# EAGLE design ALU_1 (EAGLE 5.11)
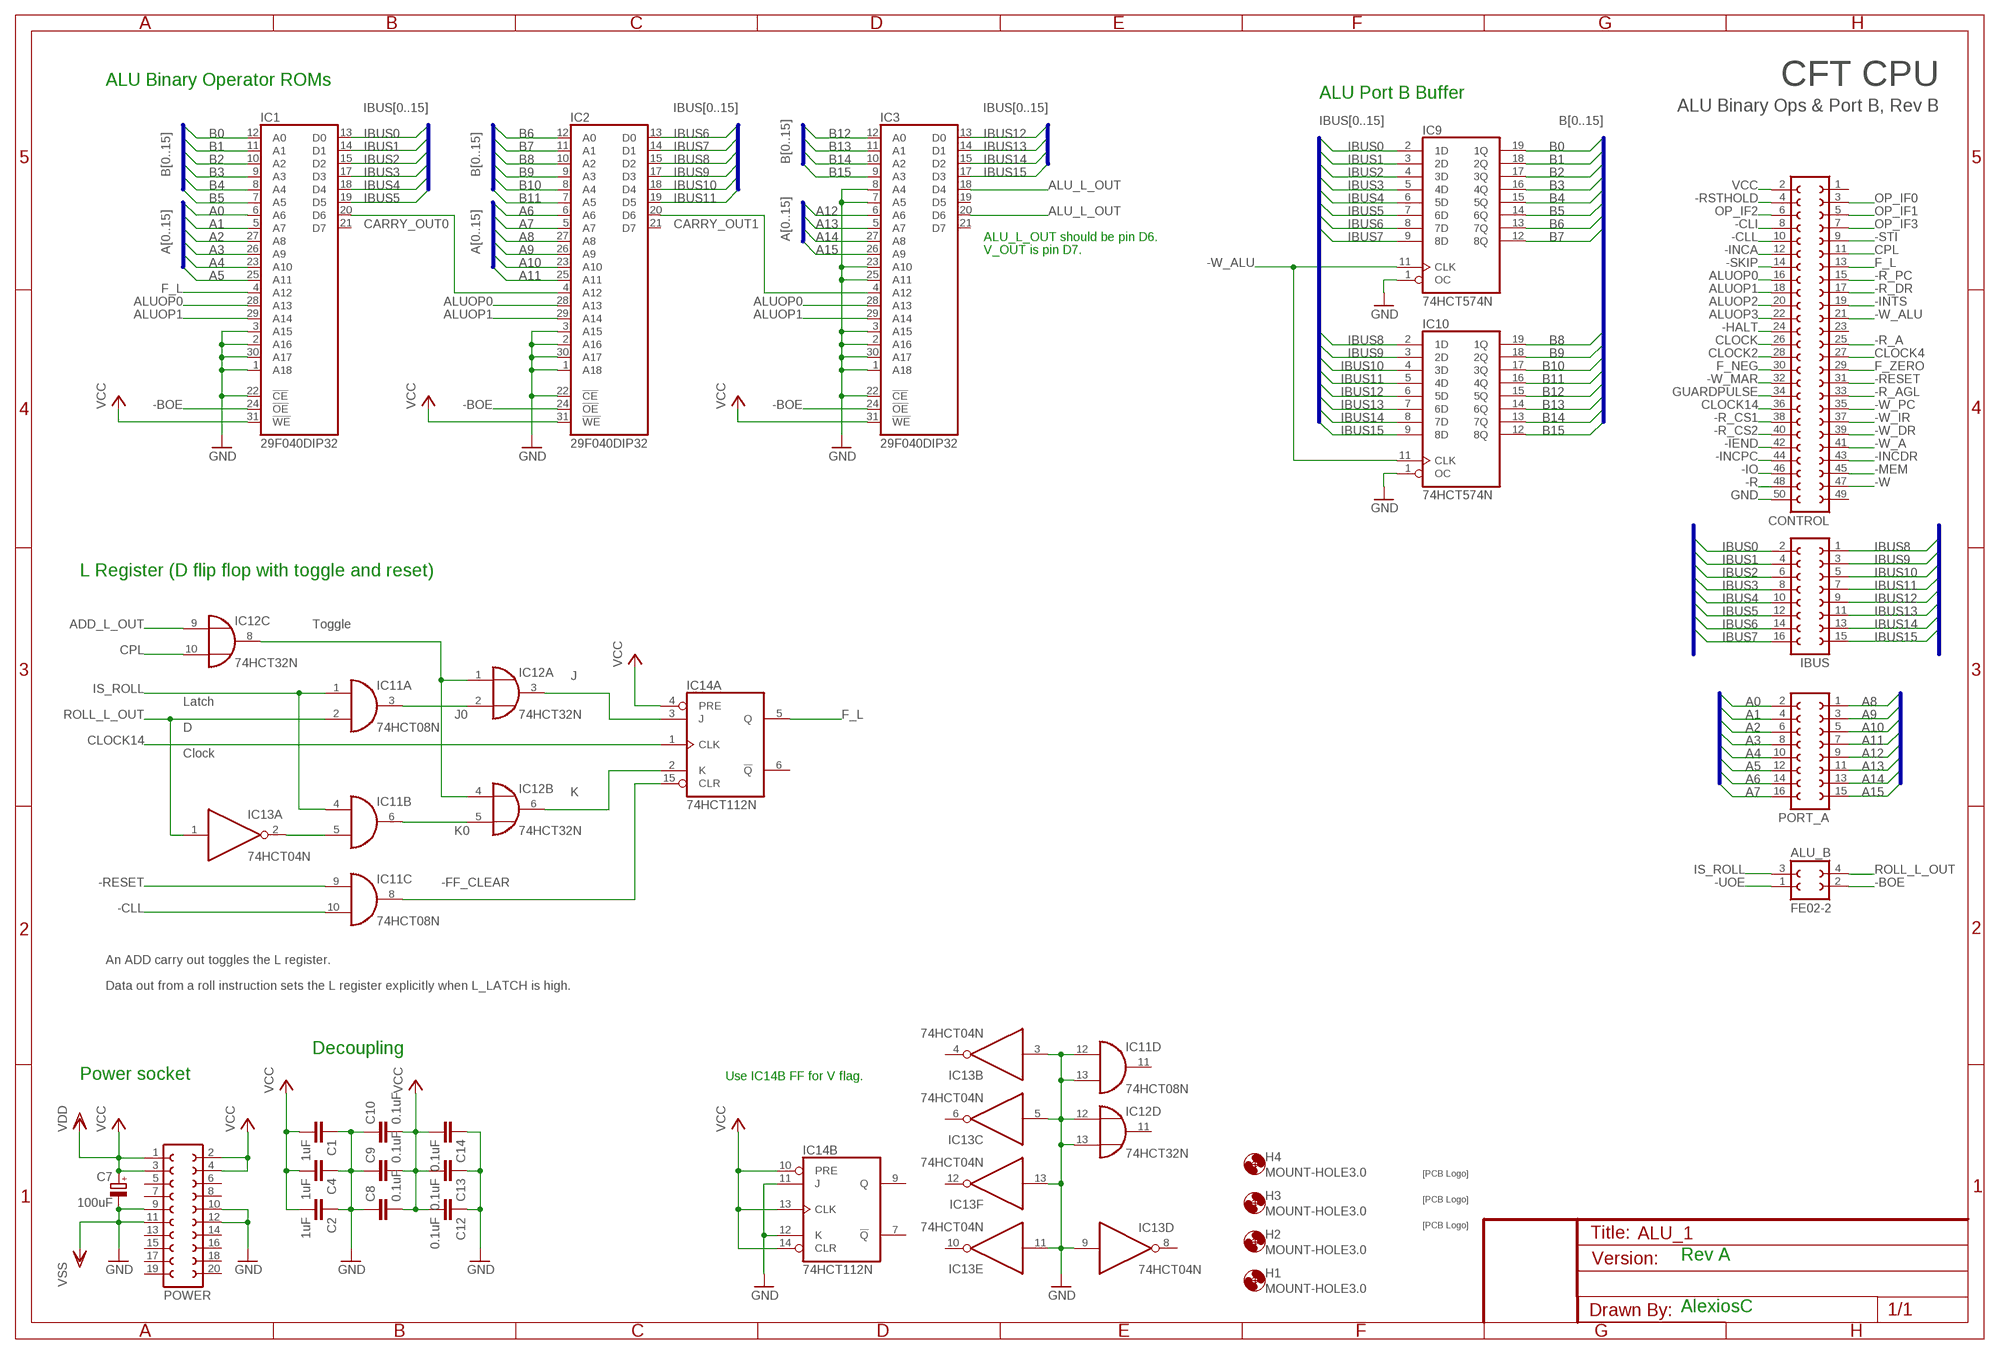
[diagram p0: schematic, sheet 1]

## Parts
ALU_B  FE02-2  [FE02-2]
C1  1uF  C-EU025-025X050  [C025-025X050]
C2  1uF  C-EU025-025X050  [C025-025X050]
C4  1uF  C-EU025-025X050  [C025-025X050]
C7  100uF  CPOL-EUE2.5-6  [E2,5-6]
C8  0.1uF  C-EU025-025X050  [C025-025X050]
C9  0.1uF  C-EU025-025X050  [C025-025X050]
C10  0.1uF  C-EU025-025X050  [C025-025X050]
C12  0.1uF  C-EU025-025X050  [C025-025X050]
C13  0.1uF  C-EU025-025X050  [C025-025X050]
C14  0.1uF  C-EU025-025X050  [C025-025X050]
CONTROL  FE25-2  [FE25-2]
H1  MOUNT-HOLE3.0  [3,0]
H2  MOUNT-HOLE3.0  [3,0]
H3  MOUNT-HOLE3.0  [3,0]
H4  MOUNT-HOLE3.0  [3,0]
IBUS  FE08-2  [FE08-2]
IC1  29F040DIP32  [DIL32]
IC2  29F040DIP32  [DIL32]
IC3  29F040DIP32  [DIL32]
IC9  74HCT574N  [DIL20]
IC10  74HCT574N  [DIL20]
IC11  74HCT08N  [DIL14]
IC12  74HCT32N  [DIL14]
IC13  74HCT04N  [DIL14]
IC14  74HCT112N  [DIL16]
PORT_A  FE08-2  [FE08-2]
POWER  FE10-2  [FE10-2]
U$1  SIGNATUREPLANE  [SIGNATURE_PLANE]
U$2  SIGNATUREPLANE  [SIGNATURE_PLANE]
U$3  SIGNATURESILK  [SIGNATURE]

## Nets
-BOE: ALU_B.2 IC1.24(!OE) IC2.24(!OE) IC3.24(!OE)
-CLI: CONTROL.8
-CLL: CONTROL.10 IC11.10(C:I1)
-FF_CLEAR: IC11.8(C:O) IC14.15(A:CLR)
-HALT: CONTROL.24
-IEND: CONTROL.42
-INCA: CONTROL.12
-INCDR: CONTROL.43
-INCPC: CONTROL.44
-INTS: CONTROL.19
-IO: CONTROL.46
-MEM: CONTROL.45
-R: CONTROL.48
-R_A: CONTROL.25
-R_AGL: CONTROL.33
-R_CS1: CONTROL.38
-R_CS2: CONTROL.40
-R_DR: CONTROL.17
-R_PC: CONTROL.15
-RESET: CONTROL.31 IC11.9(C:I0)
-RSTHOLD: CONTROL.4
-SKIP: CONTROL.14
-STI: CONTROL.9
-UOE: ALU_B.1
-W: CONTROL.47
-W_A: CONTROL.41
-W_ALU: CONTROL.21 IC9.11(CLK) IC10.11(CLK)
-W_DR: CONTROL.39
-W_IR: CONTROL.37
-W_MAR: CONTROL.32
-W_PC: CONTROL.35
A0: IC1.6(A6) PORT_A.2
A1: IC1.5(A7) PORT_A.4
A2: IC1.27(A8) PORT_A.6
A3: IC1.26(A9) PORT_A.8
A4: IC1.23(A10) PORT_A.10
A5: IC1.25(A11) PORT_A.12
A6: IC2.6(A6) PORT_A.14
A7: IC2.5(A7) PORT_A.16
A8: IC2.27(A8) PORT_A.1
A9: IC2.26(A9) PORT_A.3
A10: IC2.23(A10) PORT_A.5
A11: IC2.25(A11) PORT_A.7
A12: IC3.6(A6) PORT_A.9
A13: IC3.5(A7) PORT_A.11
A14: IC3.27(A8) PORT_A.13
A15: IC3.26(A9) PORT_A.15
ADD_L_OUT: IC12.9(C:I0)
ALU_L_OUT: IC3.18(D4)
ALUOP0: CONTROL.16 IC1.28(A13) IC2.28(A13) IC3.28(A13)
ALUOP1: CONTROL.18 IC1.29(A14) IC2.29(A14) IC3.29(A14)
ALUOP2: CONTROL.20
ALUOP3: CONTROL.22
B0: IC1.12(A0) IC9.19(1Q)
B1: IC1.11(A1) IC9.18(2Q)
B2: IC1.10(A2) IC9.17(3Q)
B3: IC1.9(A3) IC9.16(4Q)
B4: IC1.8(A4) IC9.15(5Q)
B5: IC1.7(A5) IC9.14(6Q)
B6: IC2.12(A0) IC9.13(7Q)
B7: IC2.11(A1) IC9.12(8Q)
B8: IC2.10(A2) IC10.19(1Q)
B9: IC2.9(A3) IC10.18(2Q)
B10: IC2.8(A4) IC10.17(3Q)
B11: IC2.7(A5) IC10.16(4Q)
B12: IC3.12(A0) IC10.15(5Q)
B13: IC3.11(A1) IC10.14(6Q)
B14: IC3.10(A2) IC10.13(7Q)
B15: IC3.9(A3) IC10.12(8Q)
CARRY_OUT0: IC1.20(D6) IC2.4(A12)
CARRY_OUT1: IC2.20(D6) IC3.4(A12)
CLOCK: CONTROL.26
CLOCK2: CONTROL.28
CLOCK4: CONTROL.27
CLOCK14: CONTROL.36 IC14.1(A:CLK)
CPL: CONTROL.11 IC12.10(C:I1)
F_L: CONTROL.13 IC1.4(A12) IC14.5(A:Q)
F_NEG: CONTROL.30
F_ZERO: CONTROL.29
GND: C1.1 C2.1 C4.1 C7.- C8.1 C9.1 C10.1 C12.1 C13.1 C14.1 CONTROL.50 IC1.1(A18) IC1.2(A16) IC1.3(A15) IC1.22(!CE) IC1.30(A17) IC2.1(A18) IC2.2(A16) IC2.3(A15) IC2.22(!CE) IC2.30(A17) IC3.1(A18) IC3.2(A16) IC3.3(A15) IC3.7(A5) IC3.8(A4) IC3.22(!CE) IC3.23(A10) IC3.25(A11) IC3.30(A17) IC9.1(OC) IC10.1(OC) IC11.12(D:I0) IC11.13(D:I1) IC12.12(D:I0) IC12.13(D:I1) IC13.3(B:I) IC13.5(C:I) IC13.9(D:I) IC13.11(E:I) IC13.13(F:I) IC14.11(B:J) IC14.12(B:K) POWER.9 POWER.10 POWER.11 POWER.12 ; supply symbol labelled VSS
GUARDPULSE: CONTROL.34
IBUS0: IBUS.2 IC1.13(D0) IC9.2(1D)
IBUS1: IBUS.4 IC1.14(D1) IC9.3(2D)
IBUS2: IBUS.6 IC1.15(D2) IC9.4(3D)
IBUS3: IBUS.8 IC1.17(D3) IC9.5(4D)
IBUS4: IBUS.10 IC1.18(D4) IC9.6(5D)
IBUS5: IBUS.12 IC1.19(D5) IC9.7(6D)
IBUS6: IBUS.14 IC2.13(D0) IC9.8(7D)
IBUS7: IBUS.16 IC2.14(D1) IC9.9(8D)
IBUS8: IBUS.1 IC2.15(D2) IC10.2(1D)
IBUS9: IBUS.3 IC2.17(D3) IC10.3(2D)
IBUS10: IBUS.5 IC2.18(D4) IC10.4(3D)
IBUS11: IBUS.7 IC2.19(D5) IC10.5(4D)
IBUS12: IBUS.9 IC3.13(D0) IC10.6(5D)
IBUS13: IBUS.11 IC3.14(D1) IC10.7(6D)
IBUS14: IBUS.13 IC3.15(D2) IC10.8(7D)
IBUS15: IBUS.15 IC3.17(D3) IC10.9(8D)
IS_ROLL: ALU_B.3 IC11.1(A:I0) IC11.4(B:I0)
J: IC12.3(A:O) IC14.3(A:J)
J0: IC11.3(A:O) IC12.2(A:I1)
K: IC12.6(B:O) IC14.2(A:K)
K0: IC11.6(B:O) IC12.5(B:I1)
L_TOGGLE: IC12.1(A:I0) IC12.4(B:I0) IC12.8(C:O)
N$1: IC11.5(B:I1) IC13.2(A:O)
OP_IF0: CONTROL.3
OP_IF1: CONTROL.5
OP_IF2: CONTROL.6
OP_IF3: CONTROL.7
ROLL_L_OUT: ALU_B.4 IC11.2(A:I1) IC13.1(A:I)
VCC: C1.2 C2.2 C4.2 C7.+ C8.2 C9.2 C10.2 C12.2 C13.2 C14.2 CONTROL.2 IC1.31(!WE) IC2.31(!WE) IC3.31(!WE) IC14.4(A:PRE) IC14.10(B:PRE) IC14.13(B:CLK) IC14.14(B:CLR) POWER.1 POWER.2 POWER.3 POWER.4 ; supply symbol labelled VDD
Unconnected: CONTROL.1 CONTROL.23 CONTROL.49 IC1.21(D7) IC2.21(D7) IC3.19(D5) IC3.20(D6) IC3.21(D7) IC11.11(D:O) IC12.11(D:O) IC13.4(B:O) IC13.6(C:O) IC13.8(D:O) IC13.10(E:O) IC13.12(F:O) IC14.6(A:!Q) IC14.7(B:!Q) IC14.9(B:Q) POWER.5 POWER.6 POWER.7 POWER.8 POWER.13 POWER.14 POWER.15 POWER.16 POWER.17 POWER.18 POWER.19 POWER.20

## Buses
IBUS[0..15]
A[0..15]
B[0..15]

## Notes on the sheet
- ALU Binary Operator ROMs | CFT CPU
- ALU Port B Buffer
- ALU Binary Ops & Port B, Rev B
- ALU_L_OUT should be pin D6.
- V_OUT is pin D7.
- L Register (D flip flop with toggle and reset)
- Toggle
- Latch
- D
- Clock
- An ADD carry out toggles the L register.
- Data out from a roll instruction sets the L register explicitly when L_LATCH is high.
- Decoupling
- Power socket | Use IC14B FF for V flag.
- Rev A
- AlexiosC

## Power pins joined to a net without a drawn wire
GND: IC1.16(GND) IC2.16(GND) IC3.16(GND) IC9.10(GND) IC10.10(GND) IC11.7(P:GND) IC12.7(P:GND) IC13.7(P:GND) IC14.8(P:GND)
VCC: IC1.32(VCC) IC2.32(VCC) IC3.32(VCC) IC9.20(VCC) IC10.20(VCC) IC11.14(P:VCC) IC12.14(P:VCC) IC13.14(P:VCC) IC14.16(P:VCC)

## Library data of the parts
ALU_B = alexios:FE02-2: A 2x2 pin female header.
C1 C2 C4 C8-C10 C12-C14 = rcl:C-EU: CAPACITOR, European symbol
C7 = rcl:CPOL-EU: POLARIZED CAPACITOR, European symbol
CONTROL = con-lsta:FE25-2: FEMALE HEADER
H1-H4 = holes:MOUNT-HOLE: MOUNTING HOLE with drill center marker
IBUS PORT_A = con-lsta:FE08-2: FEMALE HEADER
IC1-IC3 = alexios:29F040: 4-mbit (512x8) Flash memory in a PLCC32 package (with socket). AM29F040 is an example of this.
IC9 IC10 = 74xx-eu:74*574: 8-bit D type FLIP FLOP bus driver
IC11 = 74xx-eu:74*08: Quad 2-input AND gate
IC12 = 74xx-eu:74*32: Quad 2-input OR gate
IC13 = 74xx-eu:74*04: Hex INVERTER
IC14 = 74xx-eu:74*112: Dual J-K negative edge triggered FLIP FLOP, preset and clear
POWER = con-lsta:FE10-2: FEMALE HEADER; OC_FARNELL: unknown; OC_NEWARK: unknown
U$1-U$3 = alexios:SIGNATURE: Soup signature

## Net classes
1 Decoupling: width 1.27 mm

## Board
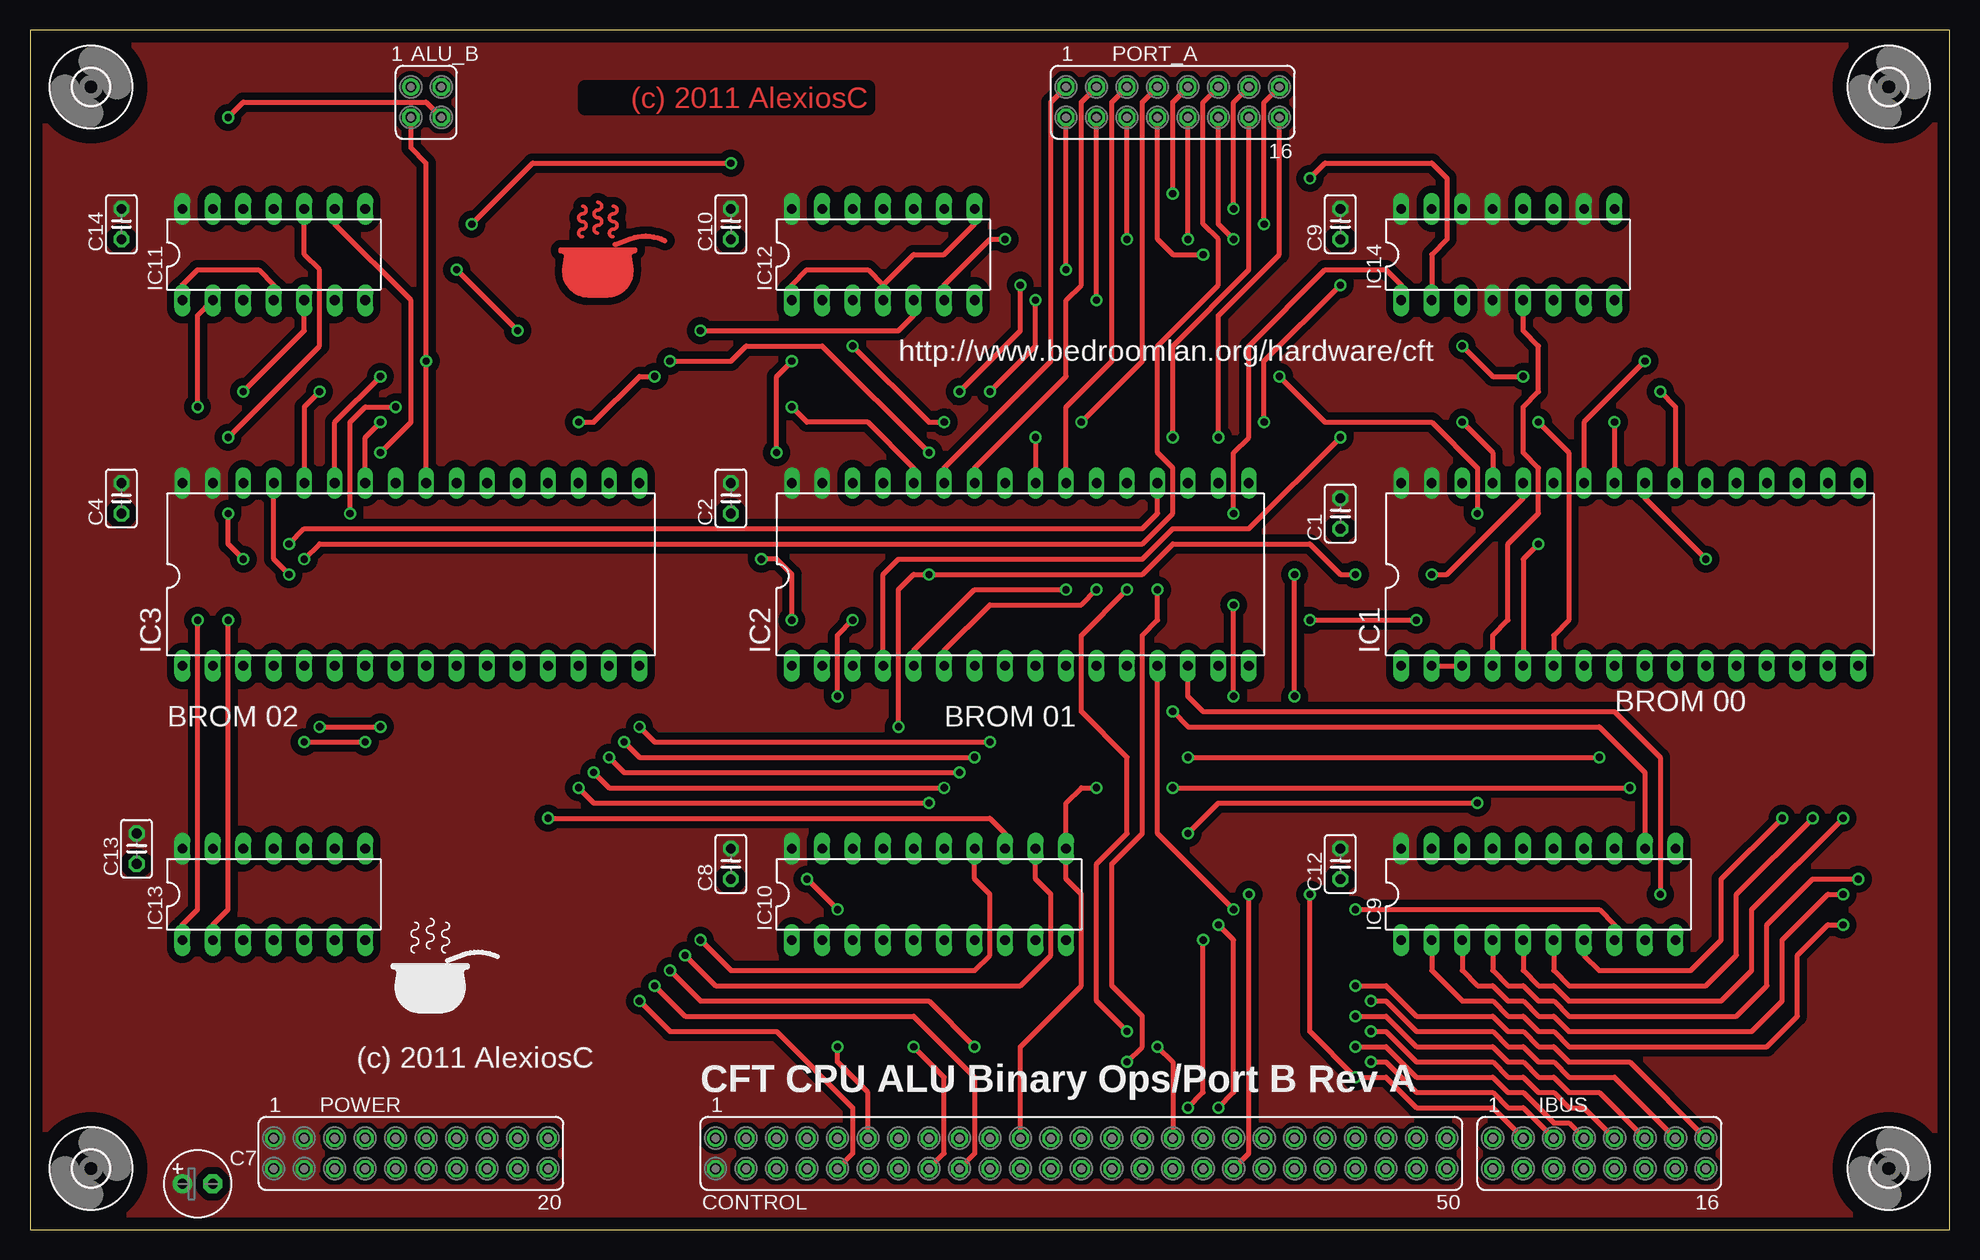
[diagram p1: board, top side]
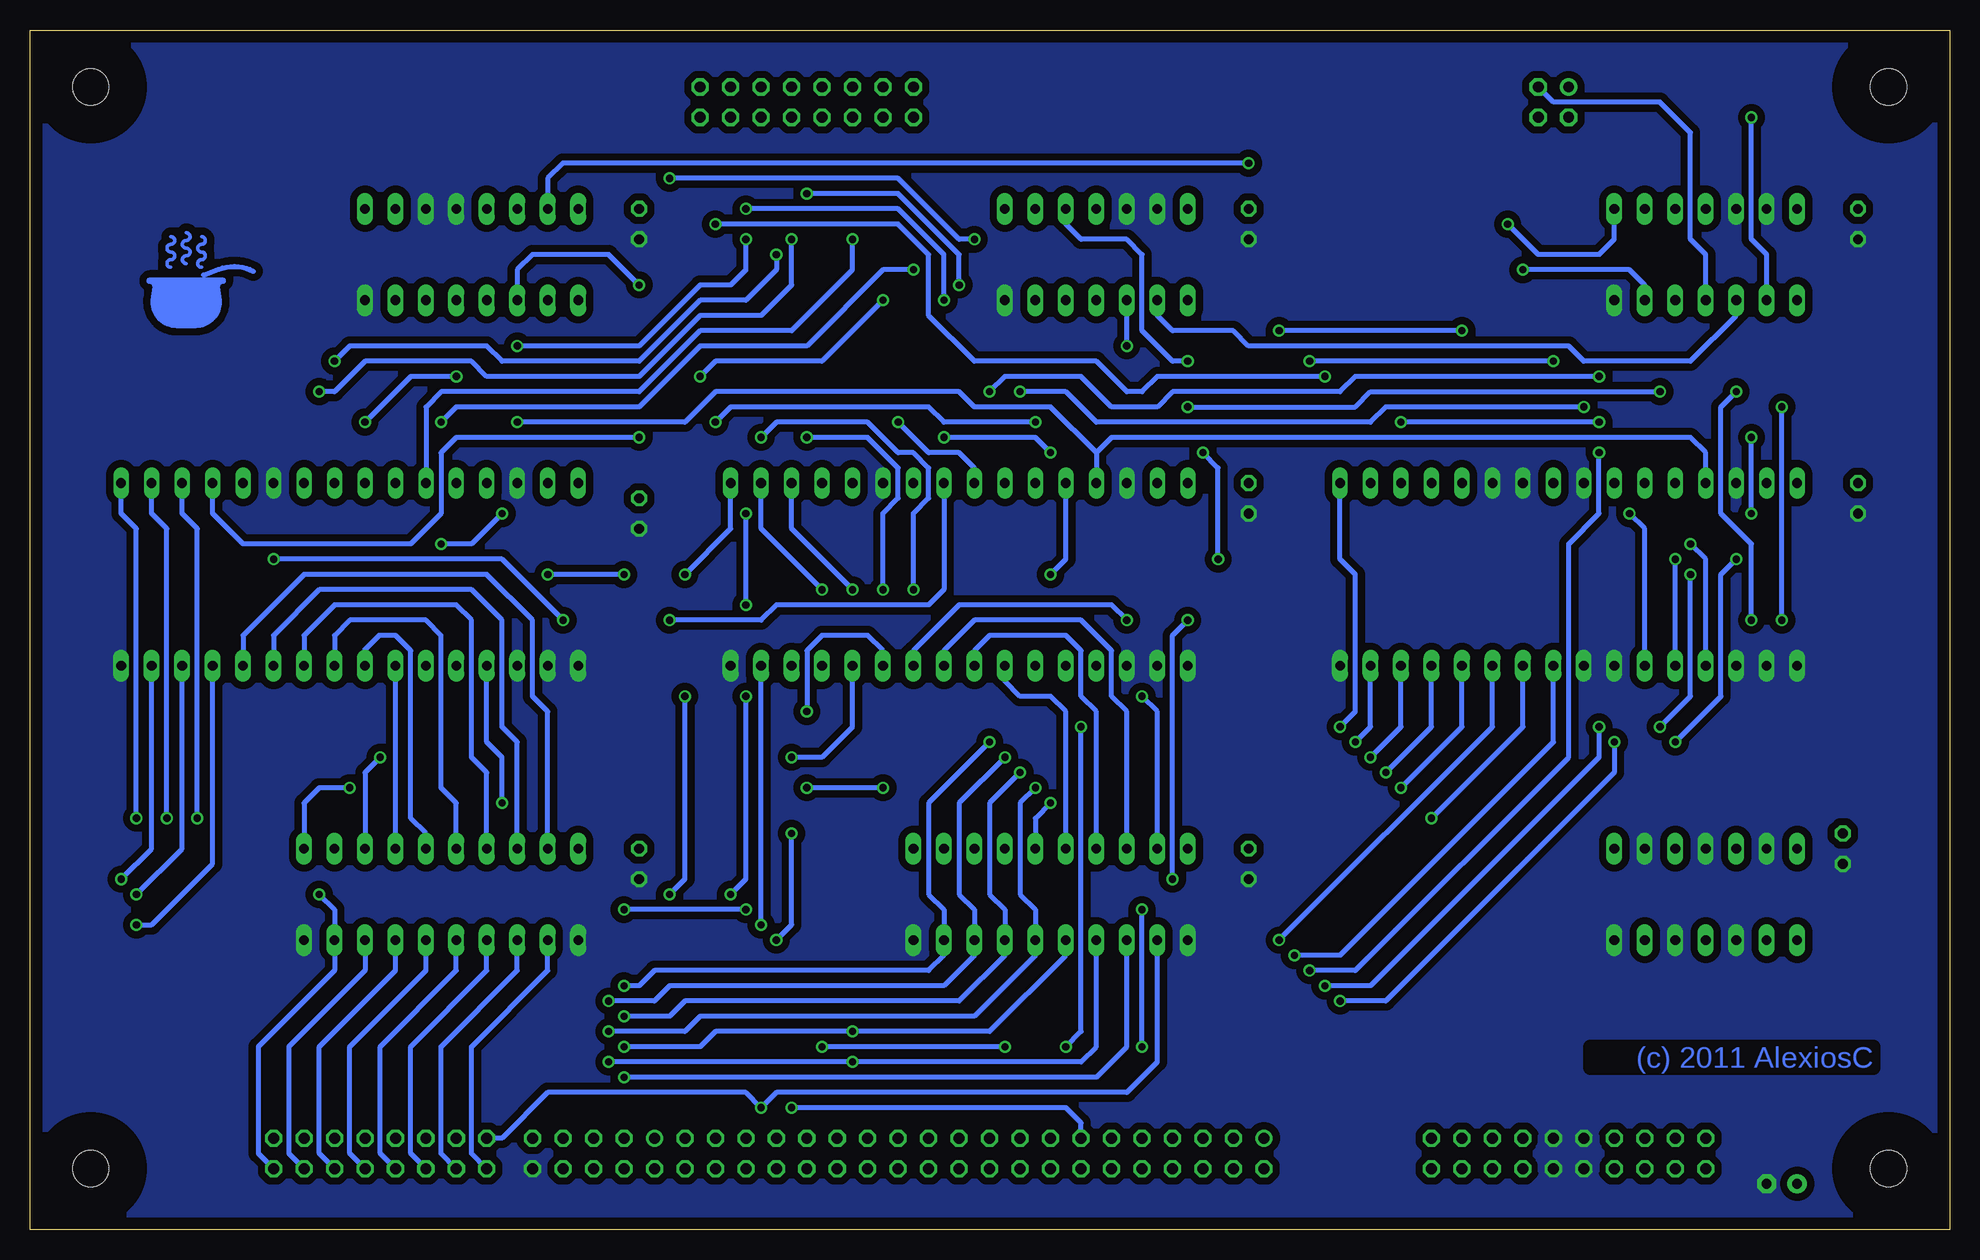
[diagram p2: board, bottom side, seen from below]

Size 160 x 100 mm. Coordinates in mm from the lower left corner, seen from the top.
Outline: 0,0 160,0 160,100 0,100 0,0
Copper layers (1*16): Top 0.035mm / dielectric 1.5mm / Bottom 0.035mm
Design rules "olimex-10mil": minimum track width 10mil, minimum drill 24mil, track to track 10mil, track to pad 10mil, pad to pad 10mil, via to via 10mil, smd to smd 10mil, copper to edge 40mil, drill to drill 10mil, minimum pad ring 10mil, minimum via ring 8mil, stop-mask expansion 0mil, vias tented up to drill 0mil, thermal gap 10mil

### Footprints (pad centres in the part's own frame; a part is rotated, then mirrored left to right if it is on the bottom)
FE02-2 = drill 0.914 round: 1 -1.27,1.27 | drill 0.914 octagon: 2 -1.27,-1.27; 3 1.27,1.27; 4 1.27,-1.27
C025-025X050 = drill 0.813 octagon: 1 -1.27,0; 2 1.27,0
E2,5-6 = drill 0.813 pad 1.6 round: + -1.27,0 | drill 0.813 pad 1.6 octagon: - 1.27,0
FE25-2 = drill 0.914 round: 1 -30.48,1.27; 41 20.32,1.27 | drill 0.914 octagon: 2 -30.48,-1.27; 3 -27.94,1.27; 4 -27.94,-1.27; 5 -25.4,1.27; 6 -25.4,-1.27; 7 -22.86,1.27; 8 -22.86,-1.27; 9 -20.32,1.27; 10 -20.32,-1.27; 11 -17.78,1.27; 12 -17.78,-1.27; 13 -15.24,1.27; 14 -15.24,-1.27; 15 -12.7,1.27; 16 -12.7,-1.27; 17 -10.16,1.27; 18 -10.16,-1.27; 19 -7.62,1.27; 20 -7.62,-1.27; 21 -5.08,1.27; 22 -5.08,-1.27; 23 -2.54,1.27; 24 -2.54,-1.27; 25 0,1.27; 26 0,-1.27; 27 2.54,1.27; 28 2.54,-1.27; 29 5.08,1.27; 30 5.08,-1.27; 31 7.62,1.27; 32 7.62,-1.27; 33 10.16,1.27; 34 10.16,-1.27; 35 12.7,1.27; 36 12.7,-1.27; 37 15.24,1.27; 38 15.24,-1.27; 39 17.78,1.27; 40 17.78,-1.27; 42 20.32,-1.27; 43 22.86,1.27; 44 22.86,-1.27; 45 25.4,1.27; 46 25.4,-1.27; 47 27.94,1.27; 48 27.94,-1.27; 49 30.48,1.27; 50 30.48,-1.27
3,0 = hole 3: 0,0
FE08-2 = drill 0.914 octagon: 1 -8.89,1.27; 2 -8.89,-1.27; 3 -6.35,1.27; 4 -6.35,-1.27; 5 -3.81,1.27; 6 -3.81,-1.27; 7 -1.27,1.27; 8 -1.27,-1.27; 9 1.27,1.27; 10 1.27,-1.27; 11 3.81,1.27; 12 3.81,-1.27; 13 6.35,1.27; 14 6.35,-1.27; 15 8.89,1.27; 16 8.89,-1.27
DIL32 = drill 0.813 long: 1 -19.05,-7.62; 2 -16.51,-7.62; 3 -13.97,-7.62; 4 -11.43,-7.62; 5 -8.89,-7.62; 6 -6.35,-7.62; 7 -3.81,-7.62; 8 -1.27,-7.62; 9 1.27,-7.62; 10 3.81,-7.62; 11 6.35,-7.62; 12 8.89,-7.62; 13 11.43,-7.62; 14 13.97,-7.62; 15 16.51,-7.62; 16 19.05,-7.62 | drill 0.8 long: 17 19.05,7.62; 18 16.51,7.62; 19 13.97,7.62; 20 11.43,7.62; 21 8.89,7.62; 22 6.35,7.62; 23 3.81,7.62; 24 1.27,7.62; 25 -1.27,7.62; 26 -3.81,7.62; 27 -6.35,7.62; 28 -8.89,7.62; 29 -11.43,7.62; 30 -13.97,7.62; 31 -16.51,7.62; 32 -19.05,7.62
DIL20 = drill 0.813 long: 1 -11.43,-3.81; 2 -8.89,-3.81; 3 -6.35,-3.81; 4 -3.81,-3.81; 5 -1.27,-3.81; 6 1.27,-3.81; 7 3.81,-3.81; 8 6.35,-3.81; 9 8.89,-3.81; 10 11.43,-3.81; 11 11.43,3.81; 12 8.89,3.81; 13 6.35,3.81; 14 3.81,3.81; 15 1.27,3.81; 16 -1.27,3.81; 17 -3.81,3.81; 18 -6.35,3.81; 19 -8.89,3.81; 20 -11.43,3.81
DIL14 = drill 0.813 long: 1 -7.62,-3.81; 2 -5.08,-3.81; 3 -2.54,-3.81; 4 0,-3.81; 5 2.54,-3.81; 6 5.08,-3.81; 7 7.62,-3.81; 8 7.62,3.81; 9 5.08,3.81; 10 2.54,3.81; 11 0,3.81; 12 -2.54,3.81; 13 -5.08,3.81; 14 -7.62,3.81
DIL16 = drill 0.813 long: 1 -8.89,-3.81; 2 -6.35,-3.81; 3 -3.81,-3.81; 4 -1.27,-3.81; 5 1.27,-3.81; 6 3.81,-3.81; 7 6.35,-3.81; 8 8.89,-3.81; 9 8.89,3.81; 10 6.35,3.81; 11 3.81,3.81; 12 1.27,3.81; 13 -1.27,3.81; 14 -3.81,3.81; 15 -6.35,3.81; 16 -8.89,3.81
FE10-2 = drill 0.914 octagon: 1 -11.43,1.27; 2 -11.43,-1.27; 3 -8.89,1.27; 4 -8.89,-1.27; 5 -6.35,1.27; 6 -6.35,-1.27; 7 -3.81,1.27; 8 -3.81,-1.27; 9 -1.27,1.27; 10 -1.27,-1.27; 11 1.27,1.27; 12 1.27,-1.27; 13 3.81,1.27; 14 3.81,-1.27; 15 6.35,1.27; 16 6.35,-1.27; 17 8.89,1.27; 18 8.89,-1.27; 19 11.43,1.27; 20 11.43,-1.27

### Placement (x,y rotation side)
ALU_B  33.02,93.98 0 top
C1  109.22,59.69 90 top
C2  58.42,60.96 90 top
C4  7.62,60.96 90 top
C7  13.97,3.81 0 top
C8  58.42,30.48 90 top
C9  109.22,83.82 90 top
C10  58.42,83.82 90 top
C12  109.22,30.48 90 top
C13  8.89,31.75 90 top
C14  7.62,83.82 90 top
CONTROL  87.63,6.35 0 top
H1  154.94,95.25 0 top
H2  154.94,5.08 0 top
H3  5.08,5.08 0 top
H4  5.08,95.25 0 top
IBUS  130.81,6.35 0 top
IC1  133.35,54.61 0 top
IC2  82.55,54.61 0 top
IC3  31.75,54.61 0 top
IC9  125.73,27.94 0 top
IC10  74.93,27.94 0 top
IC11  20.32,81.28 0 top
IC12  71.12,81.28 0 top
IC13  20.32,27.94 0 top
IC14  123.19,81.28 0 top
PORT_A  95.25,93.98 0 top
POWER  31.75,6.35 0 top
U$1  44.45,77.47 0 top
U$2  149.86,74.93 0 bottom
U$3  30.48,17.78 0 top

### Tracks (layer width: path | path; a pad name or v marks a point on that pad's centre or on a via)
-BOE  (via drill 0.6)
  Top 0.406: ALU_B.2 31.75,90.17 33.02,88.9 v33.02,72.39 IC3.24 | v83.82,66.04 IC2.24 | v53.34,72.39 58.42,72.39 59.69,73.66 66.04,73.66 v74.93,64.77 | v106.68,50.8 v115.57,50.8 | IC1.24 134.62,60.96 v139.7,55.88
  Bottom 0.406: v74.93,64.77 76.2,66.04 v83.82,66.04 | v33.02,72.39 v53.34,72.39 | IC2.24 83.82,53.34 85.09,52.07 97.79,52.07 99.06,50.8 v106.68,50.8 | v115.57,50.8 120.65,55.88 v139.7,55.88
-CLL  (via drill 0.6)
  Top 0.406: IC11.10 22.86,81.28 24.13,80.01 24.13,73.66 v16.51,66.04 | v17.78,55.88 16.51,57.15 v16.51,59.69 | v22.86,40.64 v27.94,40.64 | CONTROL.10 68.58,6.35 68.58,10.16 62.23,16.51 53.34,16.51 v50.8,19.05
  Bottom 0.406: v17.78,55.88 19.05,54.61 19.05,44.45 v22.86,40.64 | v16.51,59.69 v16.51,66.04 | v27.94,40.64 27.94,38.1 46.99,19.05 v50.8,19.05
-FF_CLEAR  (via drill 0.6)
  Top 0.406: v36.83,83.82 41.91,88.9 v58.42,88.9
  Bottom 0.406: IC14.15 116.84,87.63 115.57,88.9 v58.42,88.9 | IC11.8 27.94,82.55 29.21,81.28 34.29,81.28 v36.83,83.82
-RESET  (via drill 0.6)
  Top 0.406: v29.21,64.77 31.75,67.31 31.75,77.47 25.4,83.82 IC11.9 | CONTROL.31 95.25,13.97 v93.98,15.24 | v78.74,15.24 74.93,19.05 55.88,19.05 v53.34,21.59
  Bottom 0.406: v29.21,64.77 29.21,59.69 31.75,57.15 31.75,39.37 49.53,21.59 v53.34,21.59 | v78.74,15.24 v93.98,15.24
-W_ALU  (via drill 0.6)
  Top 0.406: CONTROL.21 82.55,15.24 87.63,20.32 87.63,27.94 86.36,29.21 IC10.11 86.36,35.56 87.63,36.83 v88.9,36.83 | v95.25,36.83 v133.35,36.83
  Bottom 0.406: IC9.11 137.16,35.56 135.89,36.83 v133.35,36.83 | v88.9,36.83 v95.25,36.83
A0  (via drill 0.6)
  Top 0.406: v86.36,80.01 PORT_A.2 | v125.73,67.31 128.27,64.77 128.27,50.8 127,49.53 IC1.6
  Bottom 0.406: v86.36,80.01 88.9,80.01 95.25,73.66 104.14,73.66 109.22,68.58 124.46,68.58 v125.73,67.31
A1  (via drill 0.6)
  Top 0.406: v120.65,59.69 120.65,63.5 116.84,67.31 107.95,67.31 v104.14,71.12 | v125.73,57.15 124.46,55.88 IC1.5 | v88.9,77.47 PORT_A.4
  Bottom 0.406: v120.65,59.69 123.19,57.15 v125.73,57.15 | v104.14,71.12 102.87,72.39 93.98,72.39 v88.9,77.47
A2  (via drill 0.6)
  Top 0.406: v91.44,82.55 PORT_A.6
  Bottom 0.406: v91.44,82.55 91.44,80.01 96.52,74.93 104.14,74.93 109.22,69.85 125.73,69.85 127,68.58 IC1.27
A3  (via drill 0.6)
  Top 0.406: v134.62,72.39 129.54,67.31 IC1.26 | v97.79,81.28 95.25,81.28 93.98,82.55 PORT_A.8
  Bottom 0.406: v97.79,81.28 97.79,80.01 100.33,77.47 104.14,77.47 109.22,72.39 120.65,72.39 121.92,73.66 133.35,73.66 v134.62,72.39
A4  (via drill 0.6)
  Top 0.406: v135.89,69.85 137.16,68.58 IC1.23 | v96.52,82.55 PORT_A.10
  Bottom 0.406: v135.89,69.85 134.62,69.85 132.08,72.39 123.19,72.39 121.92,71.12 109.22,71.12 104.14,76.2 99.06,76.2 96.52,78.74 v96.52,82.55
A5  (via drill 0.6)
  Top 0.406: v100.33,82.55 99.06,83.82 PORT_A.12 | v132.08,67.31 IC1.25 | v119.38,73.66 121.92,71.12 v124.46,71.12
  Bottom 0.406: v100.33,82.55 100.33,80.01 101.6,78.74 104.14,78.74 109.22,73.66 v119.38,73.66 | v124.46,71.12 128.27,71.12 v132.08,67.31
A6  (via drill 0.6)
  Top 0.406: PORT_A.14 101.6,80.01 95.25,73.66 v95.25,66.04 | IC2.6 76.2,48.26 80.01,52.07 87.63,52.07 v88.9,53.34
  Bottom 0.406: v95.25,66.04 90.17,66.04 87.63,63.5 87.63,60.96 88.9,59.69 v88.9,53.34
A7  (via drill 0.6)
  Top 0.406: IC2.5 73.66,48.26 78.74,53.34 v86.36,53.34 | PORT_A.16 104.14,81.28 99.06,76.2 v99.06,66.04
  Bottom 0.406: v86.36,53.34 86.36,59.69 85.09,60.96 85.09,63.5 86.36,64.77 87.63,64.77 90.17,67.31 97.79,67.31 v99.06,66.04
A8
  Top 0.406: IC2.27 76.2,63.5 85.09,72.39 85.09,93.98 PORT_A.1
A9
  Top 0.406: PORT_A.3 87.63,93.98 87.63,78.74 86.36,77.47 86.36,71.12 78.74,63.5 IC2.26
A10
  Top 0.406: PORT_A.5 90.17,93.98 90.17,72.39 86.36,68.58 IC2.23
A11  (via drill 0.6)
  Top 0.406: PORT_A.7 92.71,93.98 92.71,72.39 v87.63,67.31
  Bottom 0.406: IC2.25 81.28,63.5 82.55,64.77 85.09,64.77 v87.63,67.31
A12  (via drill 0.6)
  Top 0.406: PORT_A.9 95.25,93.98 v95.25,86.36 | v30.48,68.58 27.94,68.58 26.67,67.31 v26.67,59.69 | v82.55,78.74 82.55,74.93 v77.47,69.85
  Bottom 0.406: v95.25,86.36 87.63,86.36 82.55,81.28 v82.55,78.74 | v77.47,69.85 73.66,69.85 71.12,67.31 48.26,67.31 46.99,68.58 v30.48,68.58 | IC3.6 25.4,58.42 v26.67,59.69
A13  (via drill 0.6)
  Top 0.406: PORT_A.11 97.79,93.98 97.79,83.82 99.06,82.55 99.06,78.74 93.98,73.66 93.98,64.77 95.25,63.5 95.25,59.69 92.71,57.15 24.13,57.15 v22.86,55.88
  Bottom 0.406: IC3.5 v22.86,55.88
A14  (via drill 0.6)
  Top 0.406: PORT_A.13 100.33,93.98 v100.33,85.09 | IC3.27 25.4,67.31 v29.21,71.12 | v80.01,69.85 83.82,73.66 v83.82,77.47
  Bottom 0.406: v100.33,85.09 87.63,85.09 83.82,81.28 v83.82,77.47 | v80.01,69.85 78.74,71.12 72.39,71.12 69.85,68.58 66.04,68.58 64.77,69.85 50.8,69.85 49.53,71.12 v29.21,71.12
A15  (via drill 0.6)
  Top 0.406: PORT_A.15 102.87,93.98 v102.87,83.82 | IC3.26 27.94,66.04 v29.21,67.31 | v45.72,67.31 46.99,67.31 50.8,71.12 v52.07,71.12
  Bottom 0.406: v29.21,67.31 v45.72,67.31 | v52.07,71.12 66.04,71.12 67.31,69.85 68.58,69.85 71.12,72.39 81.28,72.39 85.09,76.2 85.09,81.28 87.63,83.82 v102.87,83.82
ALUOP0  (via drill 0.6)
  Top 0.406: CONTROL.16 76.2,6.35 76.2,12.7 v73.66,15.24 | v72.39,41.91 72.39,53.34 73.66,54.61 v74.93,54.61 92.71,54.61 95.25,57.15 106.68,57.15 109.22,54.61 v110.49,54.61 | IC3.28 22.86,68.58 v24.13,69.85 | v63.5,68.58 64.77,67.31 69.85,67.31 73.66,63.5 IC2.28 | v116.84,54.61 118.11,54.61 124.46,60.96 IC1.28
  Bottom 0.406: v73.66,15.24 72.39,16.51 v72.39,41.91 | v74.93,54.61 73.66,55.88 IC2.28 | v63.5,68.58 49.53,68.58 48.26,69.85 v24.13,69.85 | v110.49,54.61 v116.84,54.61
ALUOP1  (via drill 0.6)
  Top 0.406: CONTROL.18 78.74,6.35 78.74,12.7 73.66,17.78 54.61,17.78 v52.07,20.32 | v21.59,54.61 20.32,55.88 IC3.29 | v119.38,67.31 121.92,64.77 IC1.29 | v24.13,41.91 v29.21,41.91
  Bottom 0.406: IC3.29 20.32,64.77 21.59,66.04 69.85,66.04 71.12,64.77 | 71.12,64.77 IC2.29 | v119.38,67.31 105.41,67.31 102.87,69.85 82.55,69.85 81.28,68.58 74.93,68.58 71.12,64.77 | v21.59,54.61 21.59,44.45 v24.13,41.91 | v52.07,20.32 48.26,20.32 29.21,39.37 v29.21,41.91
B0
  Bottom 0.406: IC9.19 116.84,43.18 118.11,44.45 118.11,50.8 121.92,54.61 137.16,54.61 142.24,49.53 IC1.12
B1
  Bottom 0.406: IC9.18 119.38,40.64 120.65,41.91 120.65,50.8 123.19,53.34 135.89,53.34 139.7,49.53 IC1.11
B2
  Bottom 0.406: IC9.17 121.92,38.1 123.19,39.37 123.19,50.8 124.46,52.07 134.62,52.07 137.16,49.53 IC1.10
B3
  Bottom 0.406: IC1.9 134.62,49.53 133.35,50.8 127,50.8 125.73,49.53 125.73,36.83 124.46,35.56 IC9.16
B4
  Bottom 0.406: IC9.15 127,33.02 128.27,34.29 128.27,48.26 129.54,49.53 130.91,49.53 132.08,48.36 IC1.8
B5
  Bottom 0.406: IC9.14 IC1.7
B6  (via drill 0.6)
  Top 0.406: v96.52,39.37 v130.81,39.37
  Bottom 0.406: IC9.13 132.08,38.1 v130.81,39.37 | v96.52,39.37 93.98,39.37 91.44,41.91 IC2.12
B7  (via drill 0.6)
  Top 0.406: IC9.12 134.62,38.1 130.81,41.91 96.52,41.91 v95.25,43.18
  Bottom 0.406: v95.25,43.18 95.25,48.26 93.98,49.53 90.17,49.53 88.9,48.26 IC2.11
B8  (via drill 0.6)
  Top 0.406: v67.31,44.45 67.31,49.53 v68.58,50.8
  Bottom 0.406: IC10.19 66.04,43.18 v67.31,44.45 | v68.58,50.8 69.85,52.07 82.55,52.07 86.36,48.26 IC2.10
B9
  Bottom 0.406: IC10.18 68.58,43.18 69.85,44.45 69.85,48.26 72.39,50.8 81.28,50.8 83.82,48.26 IC2.9
B10
  Bottom 0.406: IC10.17 71.12,43.18 72.39,44.45 72.39,48.26 73.66,49.53 80.01,49.53 81.28,48.26 IC2.8
B11
  Bottom 0.406: IC10.16 73.66,43.18 74.93,44.45 77.47,44.45 78.74,45.72 IC2.7
B12  (via drill 0.6)
  Top 0.406: v74.93,35.56 46.99,35.56 v45.72,36.83
  Bottom 0.406: v74.93,35.56 76.2,34.29 IC10.15 | IC3.12 40.64,41.91 v45.72,36.83
B13  (via drill 0.6)
  Top 0.406: v55.88,24.13 58.42,21.59 78.74,21.59 80.01,22.86 80.01,27.94 78.74,29.21 IC10.14
  Bottom 0.406: IC3.11 38.1,41.91 v55.88,24.13
B14  (via drill 0.6)
  Top 0.406: v43.18,34.29 80.01,34.29 81.28,33.02 IC10.13
  Bottom 0.406: IC3.10 35.56,41.91 v43.18,34.29
B15  (via drill 0.6)
  Top 0.406: IC10.12 83.82,29.21 85.09,27.94 85.09,22.86 82.55,20.32 57.15,20.32 v54.61,22.86
  Bottom 0.406: IC3.9 33.02,40.64 50.8,22.86 v54.61,22.86
CARRY_OUT0  (via drill 0.6)
  Top 0.406: IC2.4 71.12,54.61 72.39,55.88 92.71,55.88 95.25,58.42 101.6,58.42 v109.22,66.04
  Bottom 0.406: v109.22,66.04 124.46,66.04 125.73,64.77 125.73,59.69 128.27,57.15 142.24,57.15 144.78,59.69 IC1.20
CARRY_OUT1  (via drill 0.6)
  Top 0.406: v21.59,57.15 22.86,58.42 92.71,58.42 93.98,59.69 IC2.20
  Bottom 0.406: IC3.4 20.32,55.88 v21.59,57.15
CLOCK14  (via drill 0.6)
  Top 0.406: CONTROL.36 101.6,6.35 v101.6,27.94 | v100.33,59.69 100.33,64.77 101.6,66.04 101.6,73.66 107.95,80.01 113.03,80.01 114.3,78.74 IC14.1 | v100.33,44.45 v100.33,52.07
  Bottom 0.406: v101.6,27.94 100.33,29.21 v100.33,44.45 | v100.33,52.07 v100.33,59.69
CPL  (via drill 0.6)
  Top 0.406: v67.31,26.67 v64.77,29.21 | v67.31,15.24 67.31,13.97 69.85,11.43 CONTROL.11 | v62.23,64.77 62.23,71.12 v63.5,72.39 | v63.5,50.8 63.5,54.61 62.23,55.88 v60.96,55.88
  Bottom 0.406: v60.96,55.88 60.96,63.5 v62.23,64.77 | v64.77,29.21 64.77,49.53 v63.5,50.8 | v67.31,15.24 v67.31,26.67 | v63.5,72.39 64.77,72.39 67.31,74.93 67.31,81.28 68.58,82.55 72.39,82.55 73.66,83.82 IC12.10
F_L  (via drill 0.6)
  Top 0.406: IC14.5 124.46,74.93 125.73,73.66 125.73,69.85 124.46,68.58 124.46,64.77 125.73,63.5 125.73,59.69 123.19,57.15 123.19,50.8 121.92,49.53 IC1.4 | v96.52,33.02 99.06,35.56 v120.65,35.56 | v96.52,10.16 97.79,11.43 v97.79,24.13
  Bottom 0.406: IC1.4 121.92,40.64 120.65,39.37 v120.65,35.56 | v97.79,24.13 96.52,25.4 v96.52,33.02 | v96.52,10.16 73.66,10.16 72.39,8.89 CONTROL.13
GND
  Top 0.406: IC1.2 IC1.3
  pour Bottom (isolate 0.508, no thermals): 30.48,8.89 29.21,7.62 29.21,5.08 30.48,3.81 33.02,3.81 34.29,5.08 34.29,7.62 33.02,8.89
  pour Bottom (isolate 0.61, no thermals): 0,100.33 0,0 160.02,0 160.02,100.33
IBUS0  (via drill 0.6)
  Top 0.406: IC9.2 116.84,21.59 119.38,19.05 121.92,19.05 123.19,17.78 124.46,17.78 125.73,16.51 127,16.51 128.27,15.24 144.78,15.24 147.32,17.78 147.32,22.86 149.86,25.4 v151.13,25.4
  Bottom 0.406: IBUS.2 123.19,6.35 123.19,15.24 116.84,21.59 IC9.2 | v151.13,25.4 149.86,25.4 144.78,30.48 IC1.13
IBUS1  (via drill 0.6)
  Top 0.406: IC9.3 119.38,21.59 120.65,20.32 121.92,20.32 123.19,19.05 124.46,19.05 125.73,17.78 127,17.78 128.27,16.51 143.51,16.51 146.05,19.05 146.05,24.13 149.86,27.94 v151.13,27.94
  Bottom 0.406: IBUS.4 125.73,6.35 125.73,15.24 119.38,21.59 IC9.3 | v151.13,27.94 147.32,31.75 IC1.14
IBUS2  (via drill 0.6)
  Top 0.406: IC9.4 121.92,21.59 123.19,20.32 124.46,20.32 125.73,19.05 127,19.05 128.27,17.78 142.24,17.78 144.78,20.32 144.78,25.4 148.59,29.21 v152.4,29.21
  Bottom 0.406: IBUS.6 128.27,6.35 128.27,15.24 121.92,21.59 IC9.4 | v152.4,29.21 149.86,31.75 IC1.15
IBUS3  (via drill 0.6)
  Top 0.406: IC9.5 124.46,21.59 125.73,20.32 127,20.32 128.27,19.05 140.97,19.05 143.51,21.59 143.51,26.67 v151.13,34.29
  Bottom 0.406: IBUS.8 130.81,6.35 130.81,15.24 124.46,21.59 IC9.5 | v151.13,34.29 151.13,58.42 152.4,59.69 IC1.17
IBUS4  (via drill 0.6)
  Top 0.406: IC9.6 127,21.59 128.27,20.32 139.7,20.32 142.24,22.86 142.24,27.94 v148.59,34.29
  Bottom 0.406: IBUS.10 133.35,6.35 133.35,15.24 127,21.59 IC9.6 | v148.59,34.29 148.59,58.42 149.86,59.69 IC1.18
IBUS5  (via drill 0.6)
  Top 0.406: IC9.7 129.54,22.86 130.81,21.59 138.43,21.59 140.97,24.13 140.97,29.21 v146.05,34.29
  Bottom 0.406: IBUS.12 135.89,6.35 135.89,15.24 129.54,21.59 IC9.7 | v146.05,34.29 146.05,58.42 147.32,59.69 IC1.19
IBUS6  (via drill 0.6)
  Top 0.406: IC9.8 132.08,25.4 130.81,26.67 v110.49,26.67 | IC2.13 93.98,33.02 v100.33,26.67
  Bottom 0.406: IBUS.14 138.43,6.35 138.43,15.24 132.08,21.59 IC9.8 | v100.33,26.67 v110.49,26.67
IBUS7  (via drill 0.6)
  Top 0.406: IC2.14 96.52,44.45 97.79,43.18 132.08,43.18 135.89,39.37 v135.89,27.94
  Bottom 0.406: IBUS.16 140.97,6.35 140.97,15.24 134.62,21.59 IC9.9 134.62,26.67 v135.89,27.94
IBUS8  (via drill 0.6)
  Top 0.406: v99.06,10.16 100.33,11.43 100.33,24.13 v99.06,25.4
  Bottom 0.406: IC10.2 66.04,13.97 68.58,11.43 97.79,11.43 v99.06,10.16 100.33,11.43 116.84,11.43 120.65,7.62 IBUS.1 | v99.06,25.4 IC2.15
IBUS9  (via drill 0.6)
  Top 0.406: IBUS.3 121.92,10.16 115.57,10.16 113.03,12.7 v110.49,12.7 106.68,16.51 v106.68,27.94 | v105.41,44.45 v105.41,54.61
  Bottom 0.406: IC10.3 68.58,15.24 71.12,12.7 v110.49,12.7 | IC2.17 101.6,58.42 v105.41,54.61 | v106.68,27.94 105.41,29.21 v105.41,44.45
IBUS10  (via drill 0.6)
  Top 0.406: v111.76,13.97 113.03,13.97 115.57,11.43 121.92,11.43 123.19,10.16 124.46,10.16 IBUS.5 | v93.98,53.34 93.98,50.8 92.71,49.53 92.71,33.02 90.17,30.48 90.17,20.32 92.71,17.78 92.71,15.24 v91.44,13.97
  Bottom 0.406: IC10.4 71.12,15.24 72.39,13.97 v91.44,13.97 v111.76,13.97 | IC2.18 99.06,58.42 v93.98,53.34
IBUS11  (via drill 0.6)
  Top 0.406: IBUS.7 128.27,8.89 127,8.89 124.46,11.43 123.19,11.43 121.92,12.7 115.57,12.7 113.03,15.24 v110.49,15.24 | v91.44,53.34 87.63,49.53 87.63,43.18 91.44,39.37 91.44,33.02 88.9,30.48 88.9,19.05 v91.44,16.51
  Bottom 0.406: v110.49,15.24 104.14,15.24 102.87,16.51 v91.44,16.51 80.01,16.51 73.66,22.86 IC10.5 | IC2.19 96.52,58.42 v91.44,53.34
IBUS12  (via drill 0.6)
  Top 0.406: v111.76,16.51 113.03,16.51 115.57,13.97 121.92,13.97 123.19,12.7 124.46,12.7 125.73,11.43 127,11.43 128.27,10.16 129.54,10.16 IBUS.9 | v46.99,38.1 48.26,36.83 v76.2,36.83
  Bottom 0.406: v111.76,16.51 105.41,16.51 104.14,17.78 81.28,17.78 76.2,22.86 IC10.6 76.2,26.67 77.47,27.94 77.47,35.56 v76.2,36.83 | IC3.13 43.18,41.91 v46.99,38.1
IBUS13  (via drill 0.6)
  Top 0.406: IBUS.11 130.81,11.43 128.27,11.43 127,12.7 125.73,12.7 124.46,13.97 123.19,13.97 121.92,15.24 115.57,15.24 113.03,17.78 v110.49,17.78 | v48.26,39.37 49.53,38.1 v77.47,38.1
  Bottom 0.406: v110.49,17.78 106.68,17.78 105.41,19.05 82.55,19.05 78.74,22.86 IC10.7 78.74,26.67 80.01,27.94 80.01,35.56 v77.47,38.1 | IC3.14 45.72,41.91 v48.26,39.37
IBUS14  (via drill 0.6)
  Top 0.406: IBUS.13 132.08,12.7 128.27,12.7 127,13.97 125.73,13.97 124.46,15.24 123.19,15.24 121.92,16.51 115.57,16.51 113.03,19.05 v111.76,19.05 | v49.53,40.64 50.8,39.37 v78.74,39.37
  Bottom 0.406: v111.76,19.05 107.95,19.05 106.68,20.32 83.82,20.32 81.28,22.86 IC10.8 81.28,26.67 82.55,27.94 82.55,35.56 v78.74,39.37 | IC3.15 48.26,41.91 v49.53,40.64
IBUS15  (via drill 0.6)
  Top 0.406: IBUS.15 133.35,13.97 128.27,13.97 127,15.24 125.73,15.24 124.46,16.51 123.19,16.51 121.92,17.78 115.57,17.78 113.03,20.32 v110.49,20.32 | v80.01,40.64 52.07,40.64 v50.8,41.91
  Bottom 0.406: v110.49,20.32 109.22,20.32 107.95,21.59 85.09,21.59 83.82,22.86 IC10.9 83.82,26.67 85.09,27.94 85.09,35.56 v80.01,40.64 | v50.8,41.91 49.53,43.18 49.53,54.61 50.8,55.88 IC3.17
IS_ROLL
  Top 0.406: IC11.1 12.7,78.74 13.97,80.01 19.05,80.01 20.32,78.74 IC11.4
  Bottom 0.406: ALU_B.3 33.02,93.98 24.13,93.98 21.59,91.44 21.59,82.55 20.32,81.28 IC11.4
J  (via drill 0.6)
  Top 0.406: v109.22,78.74 102.87,72.39 v102.87,67.31 | v68.58,73.66 74.93,67.31 v76.2,67.31
  Bottom 0.406: v102.87,67.31 101.6,68.58 85.09,68.58 83.82,67.31 v76.2,67.31 | v68.58,73.66 IC12.3 | v109.22,78.74 111.76,81.28 118.11,81.28 119.38,80.01 IC14.3
J0
  Bottom 0.406: IC11.3 17.78,76.2 21.59,72.39 30.48,72.39 31.75,73.66 58.42,73.66 59.69,74.93 64.77,74.93 66.04,76.2 IC12.2
K  (via drill 0.6)
  Top 0.406: IC12.6 76.2,78.74 80.01,82.55 v81.28,82.55 | v106.68,87.63 107.95,88.9 116.84,88.9 118.11,87.63 118.11,82.55 116.84,81.28 IC14.2
  Bottom 0.406: v81.28,82.55 82.55,82.55 87.63,87.63 v106.68,87.63
K0  (via drill 0.6)
  Top 0.406: v35.56,80.01 v40.64,74.93 | IC12.5 73.66,76.2 72.39,74.93 v55.88,74.93
  Bottom 0.406: v40.64,74.93 v55.88,74.93 | IC11.6 25.4,78.74 26.67,80.01 v35.56,80.01
L_TOGGLE
  Top 0.406: IC12.8 78.74,83.82 76.2,81.28 73.66,81.28 71.12,78.74 | 71.12,78.74 IC12.4 | IC12.1 63.5,78.74 64.77,80.01 69.85,80.01 71.12,78.74
N$1  (via drill 0.6)
  Top 0.406: v16.51,50.8 16.51,26.67 15.24,25.4 IC13.2 | v17.78,69.85 22.86,74.93 IC11.5
  Bottom 0.406: v17.78,69.85 19.05,68.58 19.05,59.69 16.51,57.15 v16.51,50.8
ROLL_L_OUT  (via drill 0.6)
  Top 0.406: v13.97,50.8 13.97,26.67 12.7,25.4 IC13.1 | v16.51,92.71 17.78,93.98 33.02,93.98 ALU_B.4 | v13.97,68.58 13.97,76.2 IC11.2
  Bottom 0.406: IC11.2 15.24,81.28 16.51,82.55 v16.51,92.71 | v13.97,50.8 v13.97,68.58
VCC
  pour Top (isolate 0.508, no thermals): 20.32,8.89 19.05,7.62 19.05,5.08 20.32,3.81 22.86,3.81 24.13,5.08 24.13,7.62 22.86,8.89
  pour Top (isolate 0.61, rank 6, no thermals): 0,100.33 0,0 160.02,0 160.02,100.33

### Text on the board
Top: (c) 2011 AlexiosC
Bottom: (c) 2011 AlexiosC
tNames: http://www.bedroomlan.org/hardware/cft | BROM 00 | BROM 02 | BROM 01 | (c) 2011 AlexiosC | CFT CPU ALU Binary Ops/Port B Rev A
tValues: +12V | +5V | GND